# EAGLE design Master (EAGLE 7.5.0)
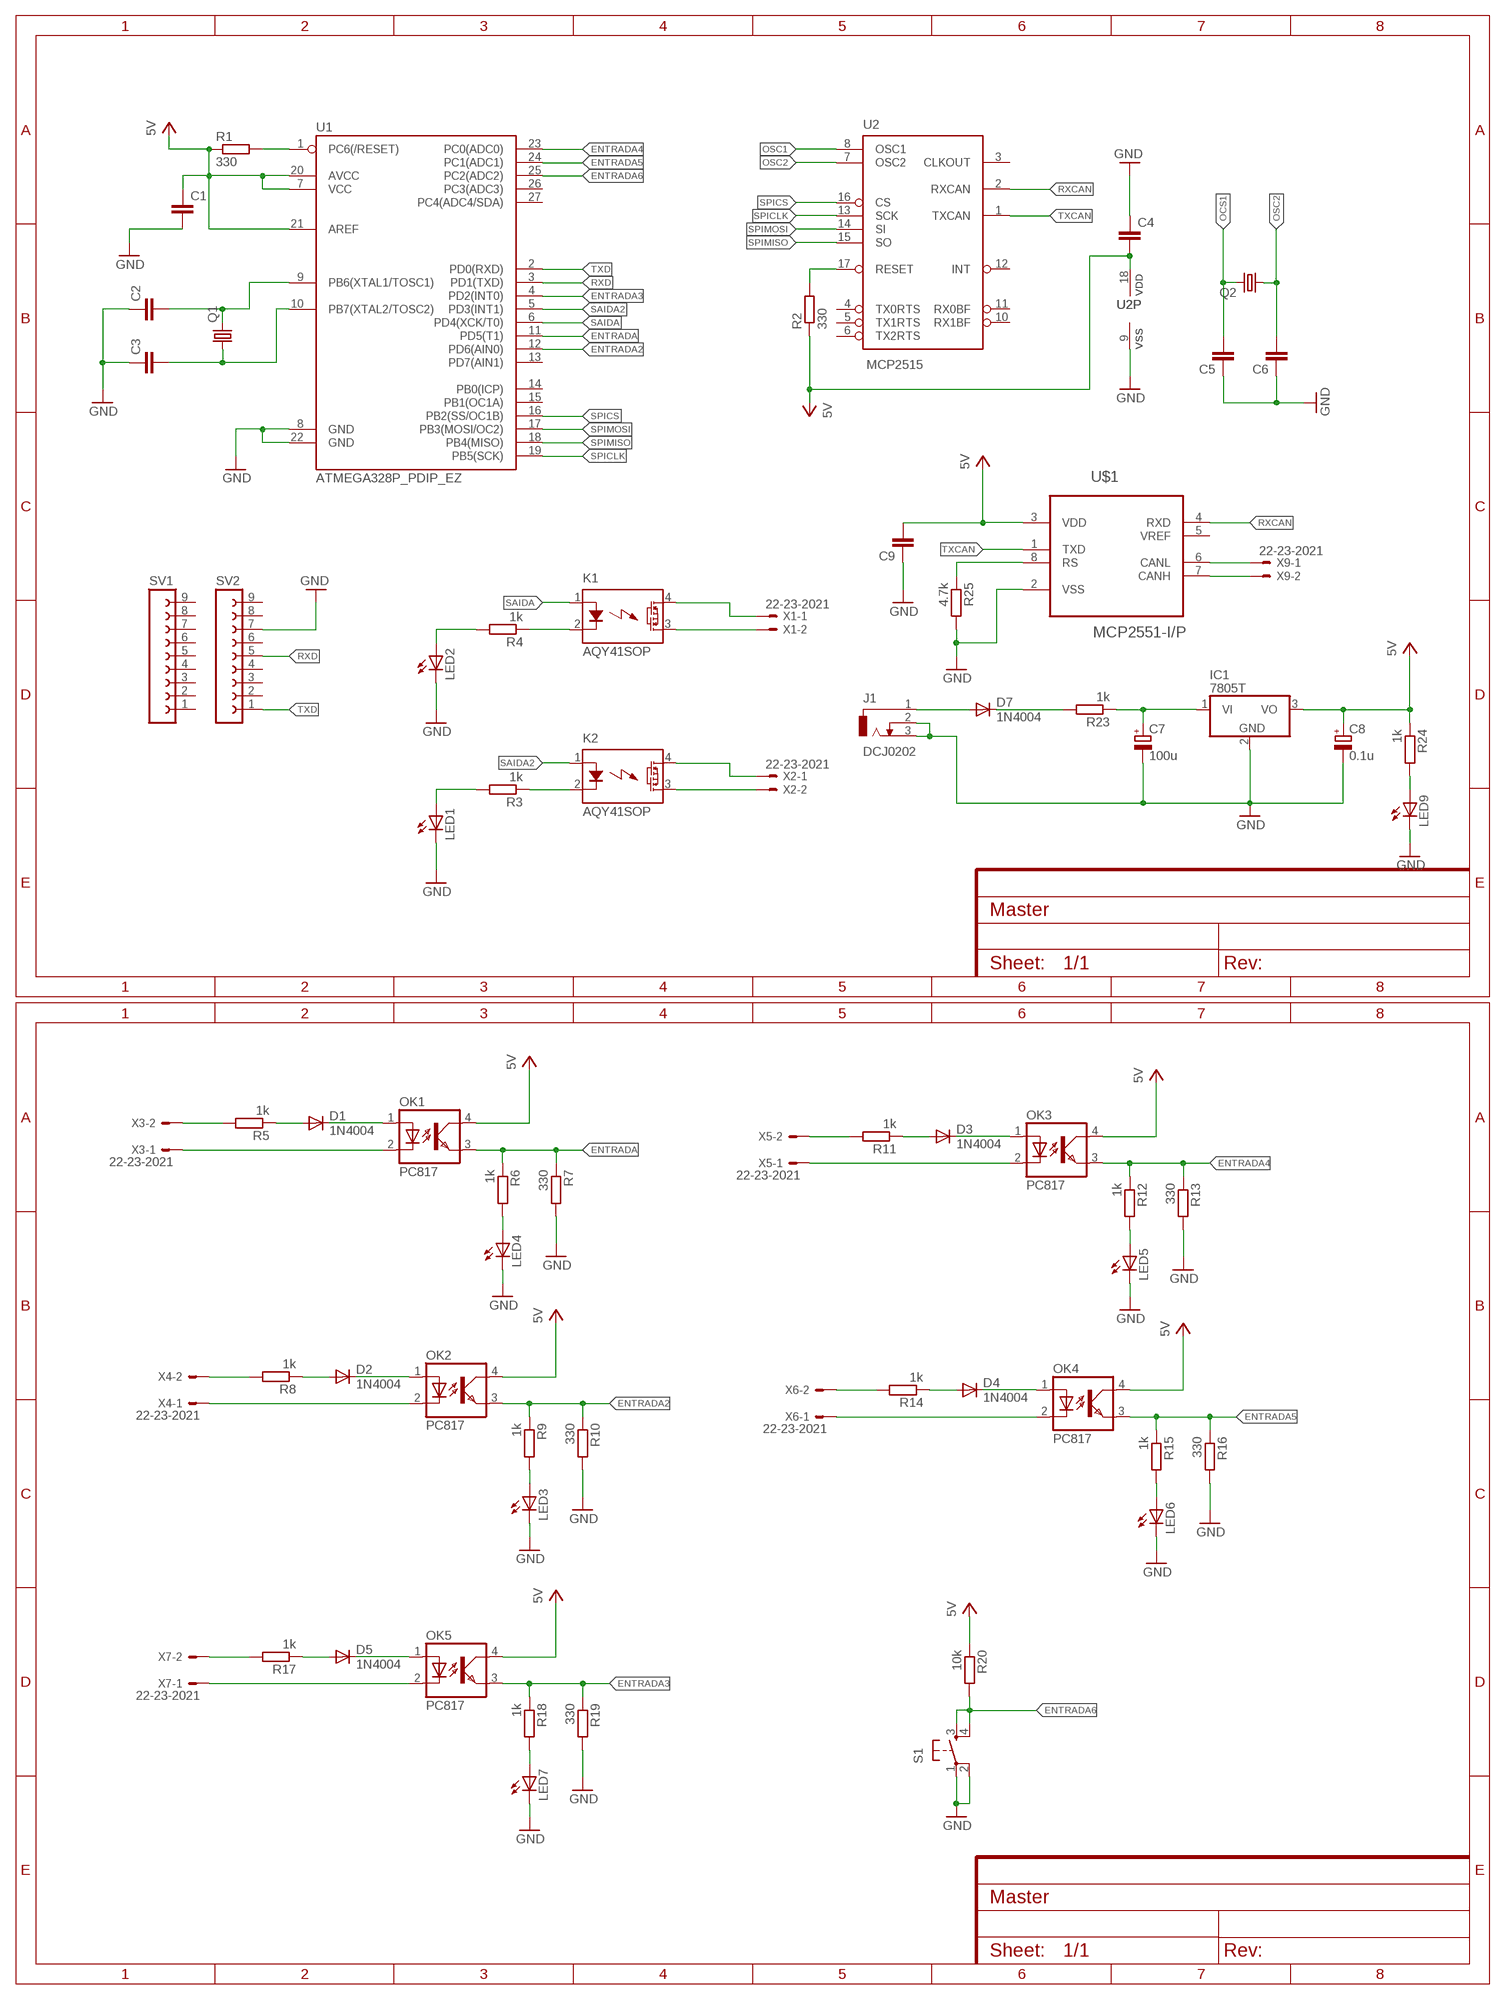
[diagram p0: schematic, sheet 1]

## Parts
C1  C2,5-3  [C2.5-3]
C2  C2,5-3  [C2.5-3]
C3  C2,5-3  [C2.5-3]
C4  C2,5-3  [C2.5-3]
C5  C2,5-3  [C2.5-3]
C6  C2,5-3  [C2.5-3]
C7  100u  CPOL-EUE2.5-6  [E2,5-6]
C8  0.1u  CPOL-EUE2.5-6  [E2,5-6]
C9  C2,5-3  [C2.5-3]
D1  1N4004  [DO41-10]
D2  1N4004  [DO41-10]
D3  1N4004  [DO41-10]
D4  1N4004  [DO41-10]
D5  1N4004  [DO41-10]
D7  1N4004  [DO41-10]
IC1  7805T  [TO220H]
J1  DCJ0202  [DCJ0202]
K1  AQY41SOP  [SOP04]
K2  AQY41SOP  [SOP04]
LED1  LED_ELD260  [LED_LD260]
LED2  LED_ELD260  [LED_LD260]
LED3  LED_ELD260  [LED_LD260]
LED4  LED_ELD260  [LED_LD260]
LED5  LED_ELD260  [LED_LD260]
LED6  LED_ELD260  [LED_LD260]
LED7  LED_ELD260  [LED_LD260]
LED9  LED_ELD260  [LED_LD260]
OK1  PC817  [DIL04]
OK2  PC817  [DIL04]
OK3  PC817  [DIL04]
OK4  PC817  [DIL04]
OK5  PC817  [DIL04]
Q1  CRYSTALHC49U70  [HC49U70]
Q2  CRYSTALHC49U70  [HC49U70]
R1  330  R-EU_0204/5  [0204/5]
R2  330  R-EU_0204/5  [0204/5]
R3  1k  R-EU_0204/5  [0204/5]
R4  1k  R-EU_0204/5  [0204/5]
R5  1k  R-EU_0204/5  [0204/5]
R6  1k  R-EU_0204/5  [0204/5]
R7  330  R-EU_0204/5  [0204/5]
R8  1k  R-EU_0204/5  [0204/5]
R9  1k  R-EU_0204/5  [0204/5]
R10  330  R-EU_0204/5  [0204/5]
R11  1k  R-EU_0204/5  [0204/5]
R12  1k  R-EU_0204/5  [0204/5]
R13  330  R-EU_0204/5  [0204/5]
R14  1k  R-EU_0204/5  [0204/5]
R15  1k  R-EU_0204/5  [0204/5]
R16  330  R-EU_0204/5  [0204/5]
R17  1k  R-EU_0204/5  [0204/5]
R18  1k  R-EU_0204/5  [0204/5]
R19  330  R-EU_0204/5  [0204/5]
R20  10k  R-EU_0204/5  [0204/5]
R23  1k  R-EU_0204/5  [0204/5]
R24  1k  R-EU_0204/5  [0204/5]
R25  4.7k  R-EU_0204/5  [0204/5]
S1  TAC_SWITCHPTH  [TACTILE-PTH]
SV1  FE09-1  [FE09]
SV2  FE09-1  [FE09]
U1  ATMEGA328P_PDIP_EZ  [DIP28-SIMON-KIT]
U2  MCP2515  MCP2515(MCP2510)P  [DIP18]
U$1  MCP2551-I/P  [DIP254P762X432-8]
X1  22-23-2021  [22-23-2021]
X2  22-23-2021  [22-23-2021]
X3  22-23-2021  [22-23-2021]
X4  22-23-2021  [22-23-2021]
X5  22-23-2021  [22-23-2021]
X6  22-23-2021  [22-23-2021]
X7  22-23-2021  [22-23-2021]
X9  22-23-2021  [22-23-2021]

## Nets
ENTRADA: OK1.3(EMIT) R6.1 R7.1 U1.11(PD5(T1))
ENTRADA2: OK2.3(EMIT) R9.1 R10.1 U1.12(PD6(AIN0))
ENTRADA3: OK5.3(EMIT) R18.1 R19.1 U1.4(PD2(INT0))
ENTRADA4: OK3.3(EMIT) R12.1 R13.1 U1.23(PC0(ADC0))
ENTRADA5: OK4.3(EMIT) R15.1 R16.1 U1.24(PC1(ADC1))
ENTRADA6: R20.2 S1.3 S1.4 U1.25(PC2(ADC2))
GND: C1.2 C2.1 C3.1 C4.1 C5.1 C6.1 C7.- C8.- C9.1 IC1.2(GND) J1.2 J1.3 LED1.K(C) LED2.K(C) LED3.K(C) LED4.K(C) LED5.K(C) LED6.K(C) LED7.K(C) LED9.K(C) R7.2 R10.2 R13.2 R16.2 R19.2 R25.2 S1.1 S1.2 SV2.7 U1.8(GND) U1.22(GND) U2.9(VSS) U$1.2(VSS)
N$1: R1.2 U1.1(PC6(/RESET))
N$2: C2.2 Q1.2 U1.9(PB6(XTAL1/TOSC1))
N$3: C3.2 Q1.1 U1.10(PB7(XTAL2/TOSC2))
N$4: R2.2 U2.17(RESET)
N$5: LED1.A R3.2
N$6: K2.2(K) R3.1
N$7: K1.2(K) R4.1
N$8: LED2.A R4.2
N$9: K1.3(DS2) X1.2
N$10: K1.4(DS1) X1.1
N$11: K2.4(DS1) X2.1
N$12: K2.3(DS2) X2.2
N$13: R5.2 X3.2
N$14: D1.A R5.1
N$15: D1.C OK1.1(A)
N$16: OK1.2(C) X3.1
N$17: R8.2 X4.2
N$18: LED4.A R6.2
N$19: D2.A R8.1
N$20: D2.C OK2.1(A)
N$21: OK2.2(C) X4.1
N$22: LED3.A R9.2
N$23: R11.2 X5.2
N$24: D3.A R11.1
N$25: D3.C OK3.1(A)
N$26: OK3.2(C) X5.1
N$27: LED5.A R12.2
N$28: R14.2 X6.2
N$29: D4.A R14.1
N$30: D4.C OK4.1(A)
N$31: OK4.2(C) X6.1
N$32: LED6.A R15.2
N$33: R17.2 X7.2
N$34: D5.A R17.1
N$35: D5.C OK5.1(A)
N$36: OK5.2(C) X7.1
N$37: LED7.A R18.2
N$43: D7.A J1.1
N$44: D7.C R23.2
N$45: C7.+ IC1.1(VI) R23.1
N$46: U$1.6(CANL) X9.1
N$47: U$1.7(CANH) X9.2
N$48: LED9.A R24.2
N$50: R25.1 U$1.8(RS)
OCS1: C5.2 Q2.2
OSC1: U2.8(OSC1)
OSC2: C6.2 Q2.1 U2.7(OSC2)
RXCAN: U2.2(RXCAN) U$1.4(RXD)
RXD: SV2.5 U1.3(PD1(TXD))
SAIDA: K1.1(A) U1.6(PD4(XCK/T0))
SAIDA2: K2.1(A) U1.5(PD3(INT1))
SPICLK: U1.19(PB5(SCK)) U2.13(SCK)
SPICS: U1.16(PB2(SS/OC1B)) U2.16(CS)
SPIMISO: U1.18(PB4(MISO)) U2.15(SO)
SPIMOSI: U1.17(PB3(MOSI/OC2)) U2.14(SI)
TXCAN: U2.1(TXCAN) U$1.1(TXD)
TXD: SV2.1 U1.2(PD0(RXD))
VCC: C1.1 C4.2 C8.+ C9.2 IC1.3(VO) OK1.4(COL) OK2.4(COL) OK3.4(COL) OK4.4(COL) OK5.4(COL) R1.1 R2.1 R20.1 R24.1 U1.7(VCC) U1.20(AVCC) U1.21(AREF) U2.18(VDD) U$1.3(VDD) ; supply symbol labelled 5V
Unconnected: SV1.1 SV1.2 SV1.3 SV1.4 SV1.5 SV1.6 SV1.7 SV1.8 SV1.9 SV2.2 SV2.3 SV2.4 SV2.6 SV2.8 SV2.9 U1.13(PD7(AIN1)) U1.14(PB0(ICP)) U1.15(PB1(OC1A)) U1.26(PC3(ADC3)) U1.27(PC4(ADC4/SDA)) U2.3(CLKOUT) U2.4(TX0RTS) U2.5(TX1RTS) U2.6(TX2RTS) U2.10(RX1BF) U2.11(RX0BF) U2.12(INT) U$1.5(VREF)

## Library data of the parts
C1-C6 C9 = capacitor-wima:C: CAPACITOR naming: grid - package width
C7 C8 = rcl:CPOL-EU: POLARIZED CAPACITOR, European symbol
D1-D5 D7 = diode:1N4004: DIODE general purpose rectifier, 1 A
IC1 = linear:78*: Positive VOLTAGE REGULATOR Source: http://cache.national.com/ds/LM/LM78L05.pdf http://www.fairchildsemi.com/ds/LM/LM7805.pdf
J1 = con-jack:DCJ0202: DC POWER JACK Source: DCJ0202.pdf; OC_FARNELL: unknown; OC_NEWARK: unknown
K1 K2 = relay:AQY*: PhotoMOS Relay NAiS Source: http://www.panasonic-electric-works.com/catalogues/downloads/photomos/ds_x615_en_aqz10_20.pdf; OC_FARNELL: unknown; OC_NEWARK: unknown
LED1-LED7 LED9 = eagle-ltspice:LED_E: LED Source: http://www.osram.convergy.de Source: www.luxeon.com Source: www.kingbright.com; SPICEMODEL: NONE; SPICEPREFIX: D; SPICETYPE: diode
OK1-OK5 = optocoupler:PC817: SHARP OPTO COUPLER; MPN: PC817X4J000F; OC_FARNELL: 9707727; OC_NEWARK: 97K7059
Q1 Q2 = crystal:CRYSTAL: CRYSTAL; OC_FARNELL: unknown; OC_NEWARK: unknown
R1-R20 R23-R25 = rcl:R-EU_: RESISTOR, European symbol
S1 = SparkFun-Retired:TAC_SWITCH: Momentary Switch Button commonly used for reset or general input. Spark Fun Electronics SKU : COM-00097 SMT- SWCH-08247
SV1 SV2 = con-lsta:FE09-1: FEMALE HEADER; OC_FARNELL: unknown; OC_NEWARK: unknown
U1 = SparkFun-IC-Microcontroller:ATMEGA328P_PDIP_EZ: Keyed ATMEGA328 DIP This is a version of the DIP package with pin 28 clipped to prevent reverse insertion. See regular 328 for product references.
U2 = SparkFun-IC-Comms:MCP2515(MCP2510): CAN controller with SPI interface The MCP2515 controller supercedes the MCP2510 while addressing all errata associated with it. The two devices are pin compatible, either can be used with this device. 18-pin package SOIC Simple SPI interface to any MCU. One-shot mode ensures message transmission is attempted only once Databyte filtering Start-of-Frame (SOF) output Low-power CMOS Technology Datasheet <http://www.sparkfun.com/datasheets/DevTools/Arduino/MCP2515.pdf> SparkFun Products CAN-BUS Shield <https://www.sparkfun.com/products/13262> (DEV-13262); PROD_ID: NA-XXXXX
U$1 = Microchip_By_element14_Batch_1:MCP2551-I/P: High-Speed CAN Transceiver; DESCRIPTION: CAN CTRL; MPN: MCP2551-I/P; OC_FARNELL: 1292240; OC_NEWARK: 61K2947; PACKAGE: PDIP-8; SUPPLIER: Microchip
X1-X7 X9 = con-molex:22-23-2021: .100" (2.54mm) Center Header - 2 Pin; MF: MOLEX; MPN: 22-23-2021; OC_FARNELL: 1462926; OC_NEWARK: 25C3832

## Board
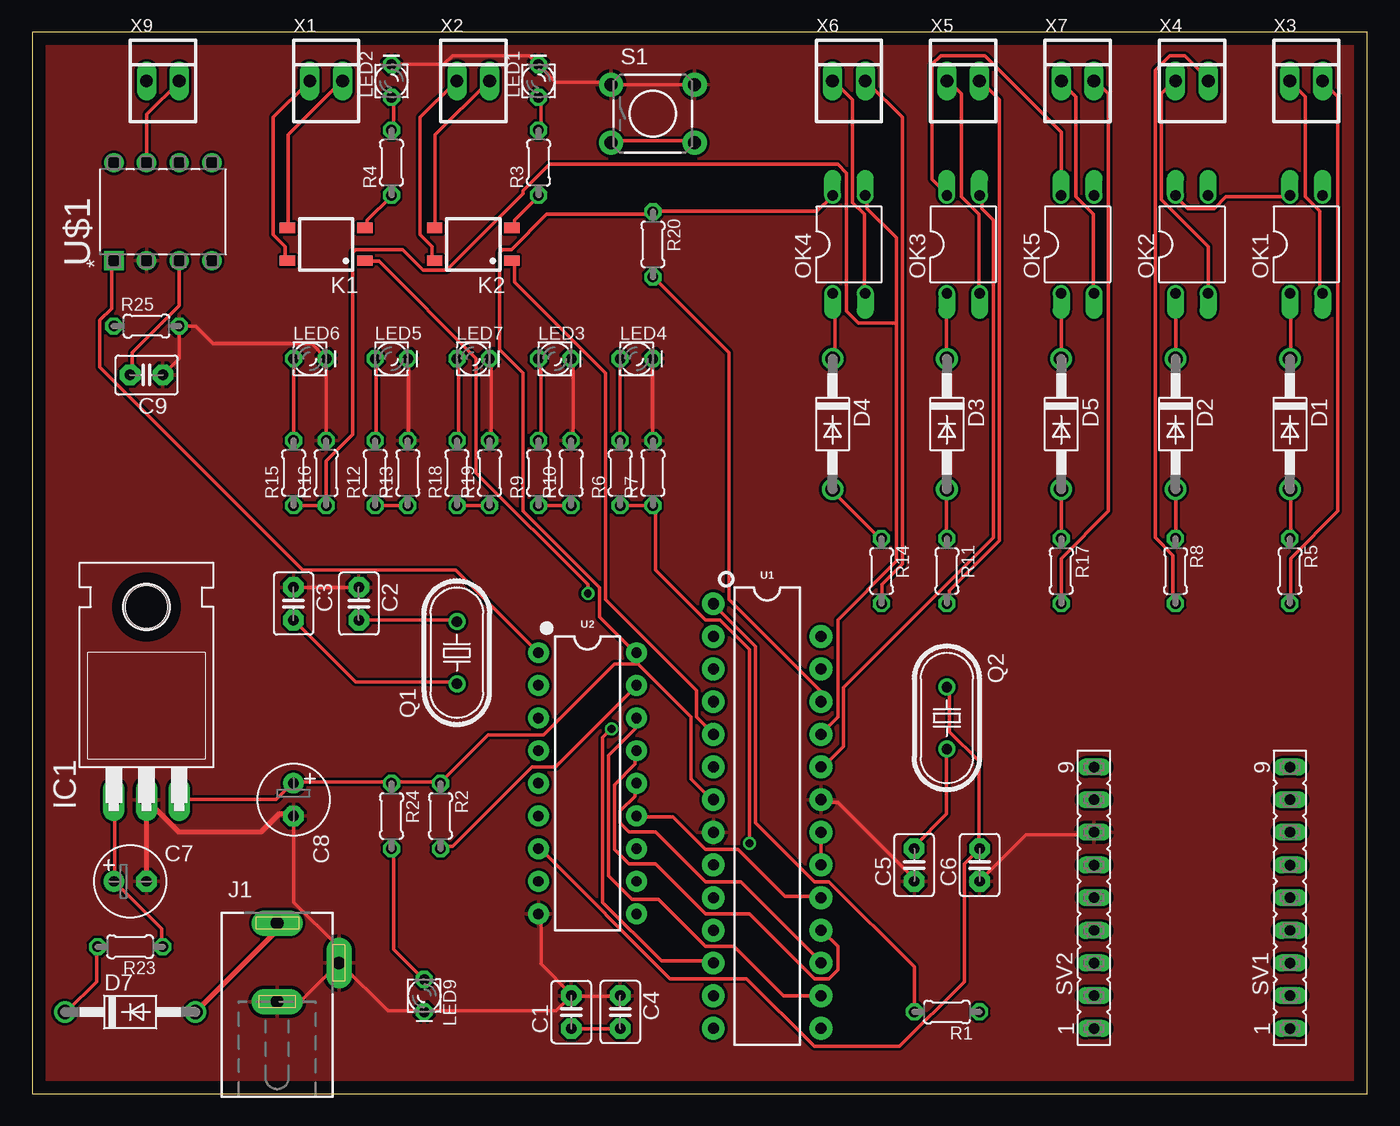
[diagram p1: board, top side]
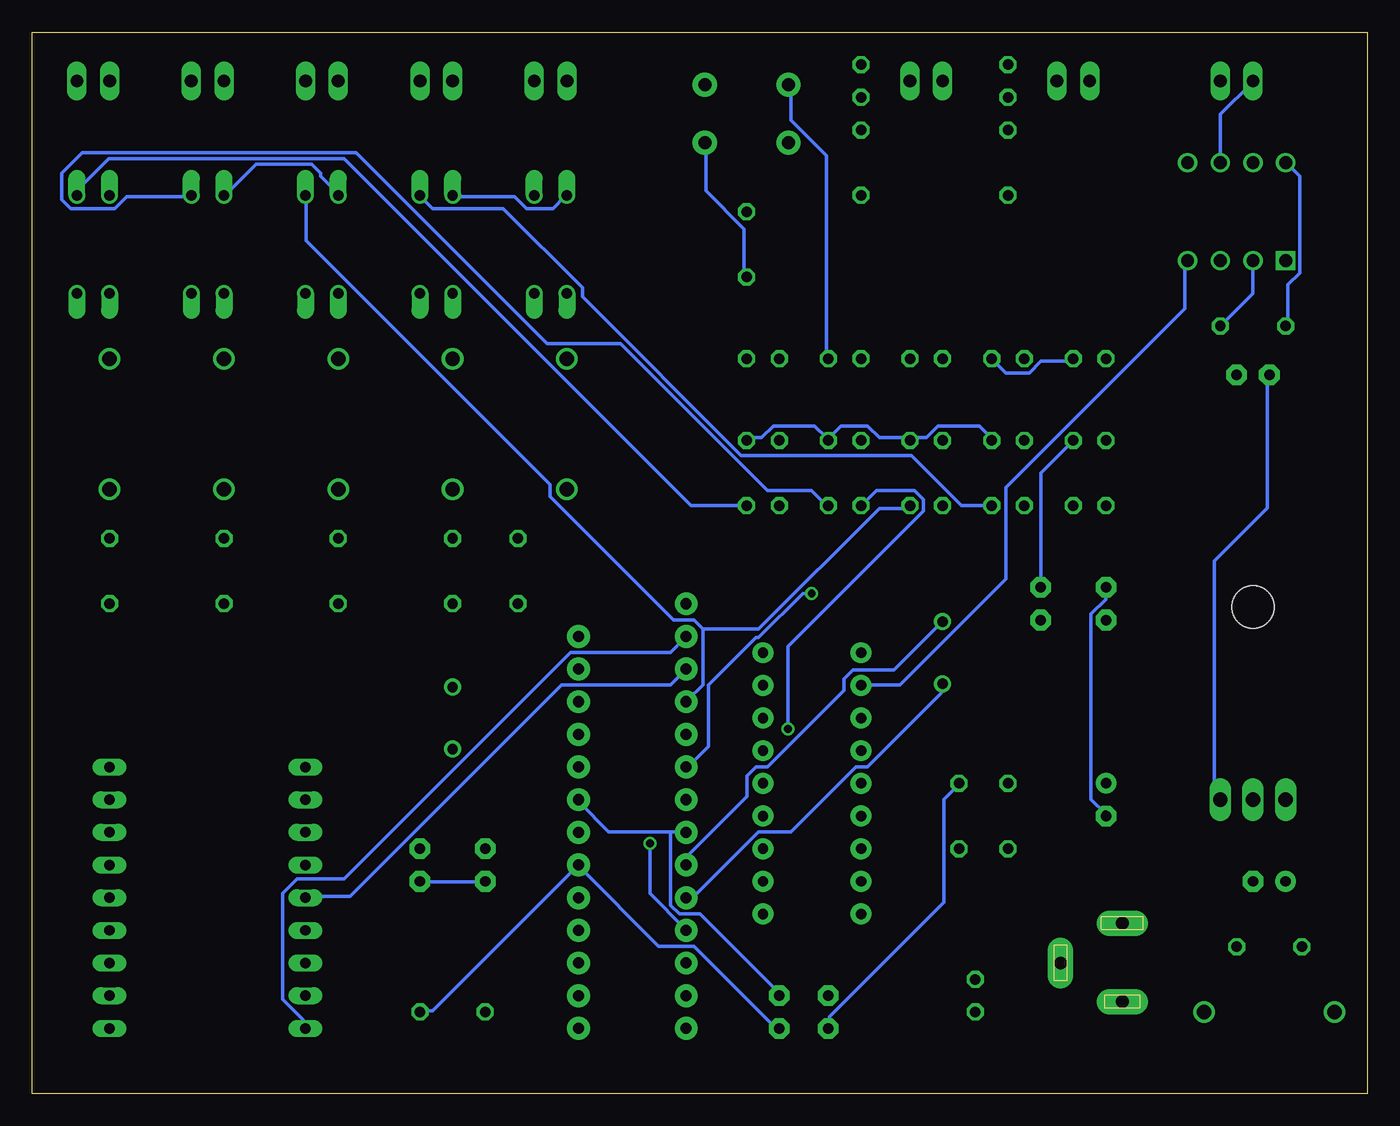
[diagram p2: board, bottom side, seen from below]

Size 103.81 x 82.54 mm. Coordinates in mm from the lower left corner, seen from the top.
Outline: 0,0 103.81,0 103.81,82.54 0,82.54 0,0
Copper layers (1*16): Top 0.035mm / dielectric 1.5mm / Bottom 0.035mm
Design rules "default": minimum track width 10mil, minimum drill 24mil, track to track 8mil, track to pad 8mil, pad to pad 8mil, via to via 8mil, smd to smd 8mil, copper to edge 40mil, drill to drill 8mil, minimum pad ring 10mil, minimum via ring 8mil, stop-mask expansion 4mil, vias tented up to drill 0mil, thermal gap 10mil

### Footprints (pad centres in the part's own frame; a part is rotated, then mirrored left to right if it is on the bottom)
C2.5-3 = drill 0.813 pad 1.6 octagon: 1 -1.27,0; 2 1.27,0
E2,5-6 = drill 0.813 pad 1.6: + -1.27,0 | drill 0.813 pad 1.6 octagon: - 1.27,0
DO41-10 = drill 1.118: A 5.08,0; C -5.08,0
TO220H = drill 1.118 long: 1 -2.54,-10.16; 2 0,-10.16; 3 2.54,-10.16 | hole 3.302: 0,4.826
DCJ0202 = drill 1 pad 2 long: 1 0,3.1; 2 4.8,0; 3 0,-3
SOP04 = smd 0.8 x 1.2: 1 -1.27,-3; 2 1.27,-3; 3 1.27,3; 4 -1.27,3
LED_LD260 = drill 0.813 octagon: A -1.27,0; K 1.27,0
DIL04 = drill 0.813 offset: 1 -1.27,-3.81; 2 1.27,-3.81; 3 1.27,3.81; 4 -1.27,3.81
HC49U70 = drill 0.813: 1 -2.413,0; 2 2.413,0
0204/5 = drill 0.813 octagon: 1 -2.54,0; 2 2.54,0
TACTILE-PTH = drill 1.016 pad 1.88: 1 -3.251,2.261; 2 3.251,2.261; 3 -3.251,-2.261; 4 3.251,-2.261
FE09 = drill 0.813 long: 1 -10.16,0; 2 -7.62,0; 3 -5.08,0; 4 -2.54,0; 5 0,0; 6 2.54,0; 7 5.08,0; 8 7.62,0; 9 10.16,0
DIP28-SIMON-KIT = drill 0.864 pad 1.778: 1 -16.51,-4.191; 2 -13.97,-4.191; 3 -11.43,-4.191; 4 -8.89,-4.191; 5 -6.35,-4.191; 6 -3.81,-4.191; 7 -1.27,-4.191; 8 1.27,-4.191; 9 3.81,-4.191; 10 6.35,-4.191; 11 8.89,-4.191; 12 11.43,-4.191; 13 13.97,-4.191; 14 16.51,-4.191; 15 16.51,4.191; 16 13.97,4.191; 17 11.43,4.191; 18 8.89,4.191; 19 6.35,4.191; 20 3.81,4.191; 21 1.27,4.191; 22 -1.27,4.191; 23 -3.81,4.191; 24 -6.35,4.191; 25 -8.89,4.191; 26 -11.43,4.191; 27 -13.97,4.191
DIP18 = drill 0.813 pad 1.626: 1 -10.16,-3.81; 2 -7.62,-3.81; 3 -5.08,-3.81; 4 -2.54,-3.81; 5 0,-3.81; 6 2.54,-3.81; 7 5.08,-3.81; 8 7.62,-3.81; 9 10.16,-3.81; 10 10.16,3.81; 11 7.62,3.81; 12 5.08,3.81; 13 2.54,3.81; 14 0,3.81; 15 -2.54,3.81; 16 -5.08,3.81; 17 -7.62,3.81; 18 -10.16,3.81
DIP254P762X432-8 = drill 0.991 square: 1 -7.62,7.62 | drill 0.991: 2 -7.62,5.08; 3 -7.62,2.54; 4 -7.62,0; 5 0,0; 6 0,2.54; 7 0,5.08; 8 0,7.62
22-23-2021 = drill 1 long: 1 -1.27,0; 2 1.27,0

### Placement (x,y rotation side)
C1  41.91,6.35 90 top
C2  25.4,38.1 270 top
C3  20.32,38.1 270 top
C4  45.72,6.35 270 top
C5  68.58,17.78 90 top
C6  73.66,17.78 90 top
C7  7.62,16.51 0 top
C8  20.32,22.86 270 top
C9  8.89,55.88 180 top
D1  97.79,52.07 270 top
D2  88.9,52.07 270 top
D3  71.12,52.07 270 top
D4  62.23,52.07 270 top
D5  80.01,52.07 270 top
D7  7.62,6.35 0 top
IC1  8.89,33.02 0 top
J1  19.05,10.16 0 top
K1  22.86,66.04 90 top
K2  34.29,66.04 90 top
LED1  39.37,78.74 90 top
LED2  27.94,78.74 90 top
LED3  40.64,57.15 0 top
LED4  46.99,57.15 0 top
LED5  27.94,57.15 0 top
LED6  21.59,57.15 0 top
LED7  34.29,57.15 0 top
LED9  30.48,7.62 270 top
OK1  99.06,66.04 0 top
OK2  90.17,66.04 0 top
OK3  72.39,66.04 0 top
OK4  63.5,66.04 0 top
OK5  81.28,66.04 0 top
Q1  33.02,34.29 90 top
Q2  71.12,29.21 270 top
R1  71.12,6.35 180 top
R2  31.75,21.59 270 top
R3  39.37,72.39 90 top
R4  27.94,72.39 90 top
R5  97.79,40.64 270 top
R6  45.72,48.26 90 top
R7  48.26,48.26 90 top
R8  88.9,40.64 270 top
R9  39.37,48.26 90 top
R10  41.91,48.26 90 top
R11  71.12,40.64 270 top
R12  26.67,48.26 90 top
R13  29.21,48.26 90 top
R14  66.04,40.64 270 top
R15  20.32,48.26 90 top
R16  22.86,48.26 90 top
R17  80.01,40.64 270 top
R18  33.02,48.26 90 top
R19  35.56,48.26 90 top
R20  48.26,66.04 270 top
R23  7.62,11.43 180 top
R24  27.94,21.59 270 top
R25  8.89,59.69 0 top
S1  48.26,76.2 0 top
SV1  97.79,15.24 90 top
SV2  82.55,15.24 90 top
U1  57.15,21.59 270 top
U2  43.18,24.13 270 top
U$1  13.97,72.39 90 top
X1  22.86,78.74 0 top
X2  34.29,78.74 0 top
X3  99.06,78.74 0 top
X4  90.17,78.74 0 top
X5  72.39,78.74 0 top
X6  63.5,78.74 0 top
X7  81.28,78.74 0 top
X9  10.16,78.74 0 top

### Tracks (layer width: path | path; a pad name or v marks a point on that pad's centre or on a via)
ENTRADA  (via drill 0.61)
  Top 0.254: R6.1 45.72,45.74 48.23,45.74 R7.1 48.46,45.52 48.46,40.72 52.35,36.83 53.49,36.83 55.78,34.54 v55.78,19.46
  Bottom 0.254: OK1.3 100.13,69.98 100.13,70.43 97.84,72.72 79.55,72.72 52.58,45.74 48.46,45.74 R7.1 | v55.78,19.46 55.78,15.57 53.03,12.83 U1.11
ENTRADA2  (via drill 0.61)
  Top 0.254: R9.1 39.55,45.74 41.83,45.74 R10.1 | v45.03,28.37 44.35,27.69 44.35,14.88 48.92,10.31 52.81,10.31 U1.12
  Bottom 0.254: OK2.3 91.44,69.75 96.47,69.75 97.38,68.83 100.81,68.83 101.5,69.52 101.5,71.58 99.9,73.18 78.64,73.18 63.78,58.32 58.06,58.32 46.63,46.89 43.2,46.89 42.06,45.74 R10.1 | v45.03,28.37 45.03,34.77 34.52,45.29 34.52,46.2 35.2,46.89 38.18,46.89 39.32,45.74 R9.1
ENTRADA3
  Top 0.254: R18.1 33.15,45.74 35.43,45.74 R19.1
  Bottom 0.254: 51.66,36.14 52.35,36.83 53.95,36.83 63.55,46.43 63.55,47.35 82.53,66.32 82.53,69.75 OK5.3 | 51.66,36.14 51.66,31.8 52.81,30.66 U1.4 | 51.66,36.14 47.32,36.14 37.95,45.52 35.66,45.52 R19.1
ENTRADA4
  Top 0.254: R12.1 26.75,45.74 29.03,45.74 R13.1 | OK3.3 73.84,69.75 73.84,68.83 74.75,67.92 74.75,43.23 63.09,31.57 63.09,27 61.49,25.4 U1.23
  Bottom 0.254: R13.1 29.26,45.74 31.55,45.74 35.43,49.63 48.69,49.63 61.04,61.98 61.04,62.66 67.21,68.83 72.69,68.83 73.61,69.75 OK3.3
ENTRADA5
  Top 0.254: 22.86,45.74 20.34,45.74 R15.1 | 67.21,59.92 67.21,41.4 62.64,36.83 62.64,29.29 61.49,28.14 U1.24 | 67.21,59.92 67.21,66.55 64.92,68.83 64.92,69.75 OK4.3 | 22.86,45.74 22.86,49.17 24.92,51.23 24.92,65.41 25.15,65.63 28.8,65.63 30.4,64.03 32.23,64.03 38.18,69.98 38.18,70.21 40.23,72.26 62.64,72.26 63.32,71.58 63.32,60.83 64.24,59.92 67.21,59.92 | 22.86,45.74 R16.1
ENTRADA6
  Top 0.254: U1.25 61.27,30.66 61.27,31.34 54.18,38.43 54.18,57.63 48.46,63.35 R20.2 | S1.3 45.03,74.09 51.44,74.09 S1.4
  Bottom 0.254: R20.2 48.46,63.58 48.46,67.23 51.44,70.21 51.44,73.86 S1.4
GND  (via drill 0.6)
  Top 0.254: LED2.K 28.12,80.04 32,80.04 32.69,80.72 38.63,80.72 39.32,80.04 LED1.K 39.55,79.81 40.69,78.66 44.81,78.66 S1.1 45.03,78.44 51.44,78.44 S1.2 | R7.2 48.23,51 48.23,56.95 LED4.K | R19.2 35.66,51 35.66,56.95 LED7.K | R10.2 42.06,51 42.06,56.95 LED3.K | C9.1 10.29,56.03 11.43,57.17 R25.2 12.7,59.69 14.07,58.32 21.72,58.32 22.86,57.17 LED6.K R16.2 | C3.1 20.34,39.34 25.38,39.34 C2.1 | R13.2 29.26,51 29.26,56.95 LED5.K | SV2.7 82.53,20.14 77.27,20.14 73.84,16.71 C6.1 | U1.22 61.49,22.66 62.64,22.66 68.58,16.71 C5.1 | C1.2 42.06,7.57 45.72,7.57 C4.1 | U2.9 39.55,13.97 39.55,10.08 41.83,7.8 C1.2 | J1.2 24,10.08 27.66,6.43 30.4,6.43 LED9.K 30.63,6.43 40.72,6.43 C1.2 | J1.3 19.2,7.34 21.03,7.34 23.77,10.08 J1.2 | C8.- 20.34,21.51 20.34,14.88 23.77,11.45 23.77,10.31 J1.2
  Top 0.406: C7.- IC1.2 11.43,20.32 17.78,20.32 19.2,21.74 v20.34,21.74
  Bottom 0.254: R7.2 48.23,51 47.09,51 46.18,51.92 42.98,51.92 42.06,51 R10.2 41.83,51 40.92,51.92 38.86,51.92 37.95,51 35.66,51 R19.2 35.43,51 34.29,51 33.38,51.92 30.18,51.92 29.26,51 R13.2 | R25.2 8.91,62.2 8.91,64.72 U$1.2 | LED6.K 22.86,56.95 25.38,56.95 26.29,56.03 28.12,56.03 29.03,56.95 LED5.K | C2.1 25.38,39.57 25.38,48.26 22.86,50.77 R16.2 | S1.1 44.81,78.44 44.81,75.69 42.06,72.95 42.06,57.17 LED3.K | 54.18,20.37 58.98,20.37 61.27,22.66 U1.22 | 54.18,20.37 53.03,20.37 U1.8 | C5.1 68.58,16.48 73.61,16.48 C6.1 | 54.18,20.37 54.18,14.66 53.49,13.97 51.89,13.97 45.72,7.8 C4.1 | C3.1 20.34,39.34 20.34,38.43 21.49,37.29 21.49,22.88 v20.34,21.74 C8.-
  pour Top: -2.54,86.36 109.22,86.36 109.22,-6.35 -7.62,-6.35 -7.62,86.36
N$1
  Top 0.254: R1.2 68.58,9.86 61.95,16.48 60.81,16.48 56.24,21.06 56.24,34.77 53.03,37.97 U1.1
N$2
  Top 0.254: C2.2 32.92,36.83 Q1.2
  Bottom 0.254: U1.9 52.81,17.86 52.81,18.54 48.23,23.11 48.23,24.71 47.55,25.4 46.63,25.4 40.69,31.34 40.69,32.26 40.01,32.94 36.8,32.94 33.15,36.6 Q1.2
N$3
  Top 0.254: Q1.1 32.92,32.03 25.15,32.03 20.34,36.83 C3.2
  Bottom 0.254: U1.10 52.81,15.34 52.35,15.34 47.32,20.37 44.81,20.37 39.78,25.4 38.86,25.4 33.15,31.11 33.15,31.8 Q1.1
N$4
  Top 0.254: R2.2 31.77,19.23 32.69,19.23 38.86,25.4 40.69,25.4 46.86,31.57 U2.17
N$5
  Top 0.254: R3.2 39.55,75.01 39.55,77.29 LED1.A
N$6
  Top 0.254: K2.2 37.49,67.46 37.49,67.92 39.32,69.75 R3.1
N$7
  Top 0.254: K1.2 26.06,67.46 26.06,67.92 27.89,69.75 R4.1
N$8
  Top 0.254: R4.2 28.12,75.01 28.12,77.29 LED2.A
N$9
  Top 0.254: K1.3 19.89,67.46 19.89,74.55 24,78.66 X1.2
N$10
  Top 0.254: K1.4 19.66,64.95 19.66,65.86 18.75,66.78 18.75,75.92 21.49,78.66 X1.1
N$11
  Top 0.254: K2.4 31.09,64.95 31.09,65.86 30.18,66.78 30.18,75.92 32.92,78.66 X2.1
N$12
  Top 0.254: K2.3 31.32,67.46 31.32,74.55 35.43,78.66 X2.2
N$13
  Top 0.254: R5.2 97.84,38.2 97.84,41.63 101.5,45.29 101.5,77.52 100.36,78.66 X3.2
N$14
  Top 0.254: R5.1 97.84,43.23 97.84,46.89 D1.A
N$15
  Top 0.254: OK1.1 97.84,62.2 97.84,57.17 D1.C
N$16
  Top 0.254: OK1.2 100.13,62.43 100.13,68.61 98.98,69.75 98.98,77.52 97.84,78.66 X3.1
N$17
  Top 0.254: R8.2 88.7,38.2 88.7,41.86 87.33,43.23 87.33,79.58 88.47,80.72 89.61,80.72 91.44,78.89 X4.2
N$18
  Top 0.254: LED4.A R6.2
N$19
  Top 0.254: R8.1 88.92,43.23 88.92,46.89 D2.A
N$20
  Top 0.254: OK2.1 88.92,62.2 88.92,57.17 D2.C
N$21
  Top 0.254: OK2.2 91.44,65.86 87.78,69.52 87.78,77.75 88.7,78.66 X4.1
N$22
  Top 0.254: R9.2 39.55,51 39.55,56.95 LED3.A
N$23
  Top 0.254: R11.2 71.32,38.2 71.32,39.12 75.21,43 75.21,77.29 73.84,78.66 X5.2
N$24
  Top 0.254: R11.1 71.09,43.23 71.09,46.89 D3.A
N$25
  Top 0.254: OK3.1 71.09,62.2 71.09,57.17 D3.C
N$26
  Top 0.254: OK3.2 73.61,62.43 73.61,68.38 72.24,69.75 72.24,77.75 71.32,78.66 X5.1
N$27
  Top 0.254: R12.2 26.75,51 26.75,56.95 LED5.A
N$28
  Top 0.254: R14.2 66.06,38.2 66.06,39.57 67.67,41.17 67.67,75.92 64.92,78.66 X6.2
N$29
  Top 0.254: R14.1 65.84,43.23 62.18,46.89 D4.A
N$30
  Top 0.254: OK4.1 62.41,62.2 62.41,57.17 D4.C
N$31
  Top 0.254: OK4.2 64.69,62.43 64.69,68.38 63.78,69.29 63.78,77.29 62.41,78.66 X6.1
N$32
  Top 0.254: R15.2 20.34,51 20.34,56.95 LED6.A
N$33
  Top 0.254: R17.2 80.01,41.63 83.67,45.29 83.67,77.75 82.75,78.66 X7.2
N$34
  Top 0.254: D5.A R17.1
N$35
  Top 0.254: D5.C OK5.1
N$36
  Top 0.254: OK5.2 82.53,62.43 82.53,68.38 81.15,69.75 81.15,77.52 80.01,78.66 X7.1
N$37
  Top 0.254: R18.2 33.15,51 33.15,56.95 LED7.A
N$43
  Top 0.406: J1.1 19.05,12.7 D7.A
N$44
  Top 0.254: R23.2 5.03,11.23 5.03,8.71 2.74,6.43 D7.C
N$45
  Top 0.254: R23.1 10.06,11.45 10.06,12.83 6.4,16.48 C7.+ 6.4,16.71 6.4,22.66 IC1.1
N$46
  Bottom 0.254: U$1.6 11.43,76.15 8.91,78.66 X9.1
N$47
  Top 0.254: U$1.7 8.91,72.49 8.91,76.15 11.43,78.66 X9.2
N$48
  Top 0.254: R24.2 28.12,19 28.12,11.23 30.4,8.94 LED9.A
N$50
  Bottom 0.254: R25.1 6.17,59.69 6.17,62.89 5.26,63.8 5.26,71.35 6.17,72.26 U$1.8
OCS1
  Top 0.254: Q2.2 71.09,26.77 71.09,21.74 68.58,19.23 C5.2
OSC2
  Top 0.254: Q2.1 71.32,31.57 71.32,28.14 73.61,25.86 73.61,19.23 C6.2 72.47,17.86 72.47,8.71 67.44,3.68 60.81,3.68 55.55,8.94 49.61,8.94 39.55,19 U2.7
RXCAN
  Bottom 0.254: U$1.4 14.17,64.72 14.17,61.06 28.12,47.12 28.12,40.03 36.35,31.8 39.32,31.8 U2.2
RXD
  Bottom 0.254: U1.3 54.18,31.8 62.64,31.8 79.1,15.34 82.53,15.34 SV2.5
SAIDA  (via drill 0.61)
  Top 0.254: v43.2,38.89 43.2,39.57 34.52,48.26 34.52,57.17 26.98,64.72 26.06,64.72 K1.1
  Bottom 0.254: v43.2,38.89 43.89,38.89 47.32,35.46 47.55,35.46 51.21,31.8 51.21,27 52.81,25.4 U1.6
SAIDA2
  Top 0.254: K2.1 37.49,64.72 37.49,63.12 44.58,56.03 44.58,38.43 51.66,31.34 51.66,29.29 52.81,28.14 U1.5
SPICLK
  Top 0.254: U2.13 47.09,21.51 49.84,21.51 52.35,19 54.86,19 58.52,15.34 61.27,15.34 U1.19
SPICS
  Top 0.254: U2.16 46.86,29.06 46.86,28.37 44.81,26.31 44.81,16.94 46.63,15.11 48.69,15.11 52.35,11.45 54.59,11.45 58.42,7.62 U1.16
SPIMISO
  Top 0.254: U2.15 46.86,26.54 46.86,25.63 45.26,24.03 45.26,19 46.41,17.86 48.46,17.86 52.35,13.97 55.78,13.97 60.81,8.94 61.95,8.94 62.64,9.63 62.64,11.45 61.49,12.6 U1.18
SPIMOSI
  Top 0.254: U2.14 46.86,24.03 46.86,23.11 45.72,21.97 45.72,21.06 46.41,20.37 48.46,20.37 52.35,16.48 55.09,16.48 61.27,10.31 U1.17
TXCAN
  Top 0.254: U$1.1 6.17,64.72 6.17,61.06 5.26,60.15 5.26,56.49 21.03,40.72 32.92,40.72 39.32,34.31 U2.1
TXD
  Bottom 0.254: SV2.1 82.75,5.28 82.75,5.74 84.35,7.34 84.35,15.57 83.21,16.71 79.55,16.71 61.95,34.31 54.18,34.31 53.03,35.46 U1.2
VCC
  Top 0.254: OK1.4 97.61,69.75 92.81,69.75 91.9,68.83 89.84,68.83 88.92,69.75 OK2.4 | OK4.4 62.18,69.75 61.04,68.61 48.46,68.61 R20.1 48.23,68.38 40.01,68.38 37.26,65.63 36.58,65.63 36.35,65.41 36.35,57.86 38.18,56.03 38.18,45.29 44.12,39.34 44.12,37.06 46.86,34.31 U2.18 47.09,34.09 47.09,33.4 | OK5.4 80.01,74.78 74.07,80.72 70.64,80.72 69.95,80.04 69.95,71.12 71.09,69.98 OK3.4 | C1.1 42.06,5.05 45.72,5.05 C4.2 | 47.09,33.4 51.21,29.29 51.21,24.49 52.81,22.88 U1.7 | U$1.3 11.43,61.29 7.77,57.63 7.77,56.03 C9.2 | IC1.3 11.43,22.88 18.97,22.88 20.12,24.03 C8.+ 20.34,24.26 27.89,24.26 R24.1 28.12,24.26 31.55,24.26 R2.1 31.77,24.26 35.43,27.91 39.78,27.91 45.26,33.4 47.09,33.4 | U1.20 U1.21
  Bottom 0.254: OK5.4 80.01,69.98 81.38,71.35 81.38,71.58 82.07,72.26 86.41,72.26 88.7,69.98 OK2.4 | OK3.4 71.09,69.75 66.29,69.75 65.38,68.83 63.32,68.83 62.41,69.75 OK4.4 | R1.1 73.61,6.43 72.69,6.43 U1.20 61.27,17.63 55.09,11.45 52.35,11.45 46.18,5.28 45.72,5.28 C4.2 | C9.2 7.77,55.8 7.77,45.54 11.89,41.43 11.89,23.34 11.43,22.88 IC1.3 | C1.1 41.83,5.28 41.83,5.97 32.92,14.88 32.92,22.88 31.77,24.03 R2.1